# Altium schematic sheet TOP.SchDoc: TOP
size A4; SheetNumber: 1; SheetTotal: 2
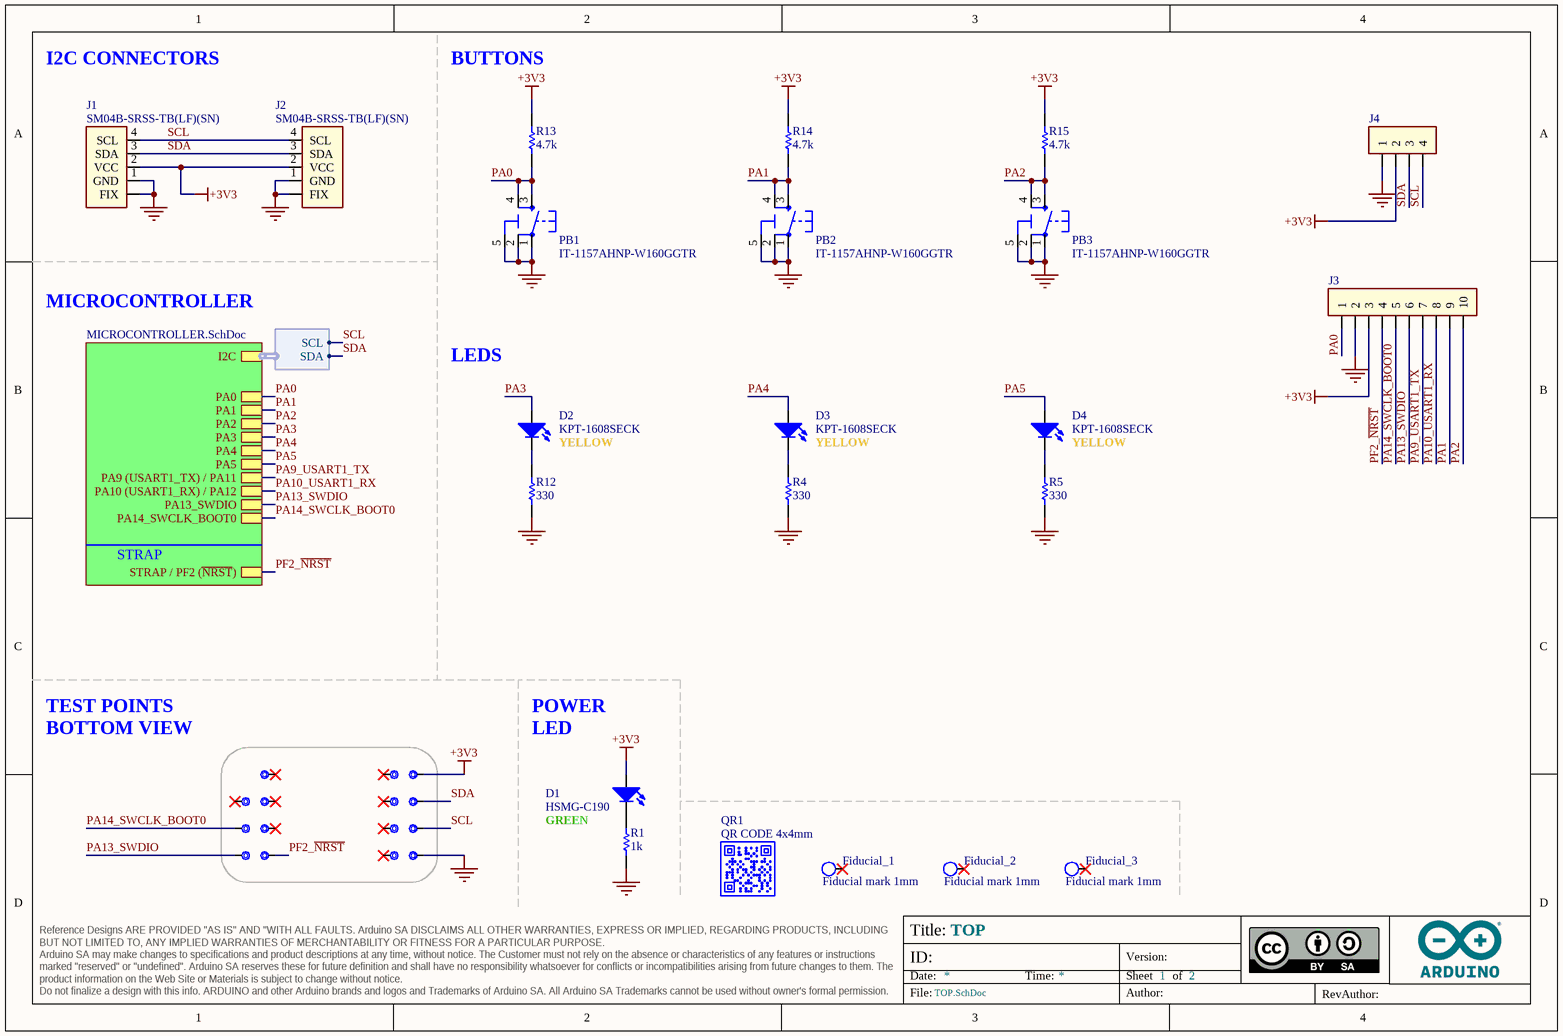
[diagram p0: TOP.SchDoc]

## Parts
3V3  Test point 1.00mm  [TP-1.00MM]  (value not drawn)  (no BOM)
D1  HSMG-C190  [LEDC1608X80N-AK]
D2  KPT-1608SECK  [LEDC1608X80N-AK]
D3  KPT-1608SECK  [LEDC1608X80N-AK]
D4  KPT-1608SECK  [LEDC1608X80N-AK]
Fiducial_1  Fiducial mark 1mm  [Fiducial mark 1mm-Footprint-1]  (no BOM)
Fiducial_2  Fiducial mark 1mm  [Fiducial mark 1mm-Footprint-1]  (no BOM)
Fiducial_3  Fiducial mark 1mm  [Fiducial mark 1mm-Footprint-1]  (no BOM)
GND  Test point 1.00mm  [TP-1.00MM]  (value not drawn)  (no BOM)
J1  SM04B-SRSS-TB(LF)(SN)  [SM04B-SRSS-TB(LF)(SN)-Footprint-1]
J2  SM04B-SRSS-TB(LF)(SN)  [SM04B-SRSS-TB(LF)(SN)-Footprint-1]
J3  HEADER TH 2.54mm VERT. 1x010POS  [PIN HEADER 2.54mm VERT. 1x10POS]  (value not drawn)  (no BOM)
J4  HEADER TH 2.54mm VERT. 1x004POS  [PIN HEADER 2.54mm VERT. 1x4POS-Footprint-1]  (value not drawn)  (no BOM)
NRST  Test point 1.00mm  [TP-1.00MM]  (value not drawn)  (no BOM)
PA6  Test point 1.00mm  [TP-1.00MM]  (value not drawn)  (no BOM)
PA7  Test point 1.00mm  [TP-1.00MM]  (value not drawn)  (no BOM)
PB1  IT-1157AHNP-W160GGTR  [TS42]
PB2  IT-1157AHNP-W160GGTR  [TS42]
PB3  IT-1157AHNP-W160GGTR  [TS42]
PC14  Test point 1.00mm  [TP-1.00MM]  (value not drawn)  (no BOM)
PC15  Test point 1.00mm  [TP-1.00MM]  (value not drawn)  (no BOM)
QR1  QR CODE 4x4mm  [QR CODE 4x4mm]  (no BOM)
R1  value 1k  [RES-0402]  (hidden comment: CRCW04021K00FKEDC)
R4  value 330  [RES-0402]  (hidden comment: CRCW0402330RJNED)
R5  value 330  [RES-0402]  (hidden comment: CRCW0402330RJNED)
R12  value 330  [RES-0402]  (hidden comment: CRCW0402330RJNED)
R13  value 4.7k  [RES-0402]  (hidden comment: RC0402FR-074K7L)
R14  value 4.7k  [RES-0402]  (hidden comment: RC0402FR-074K7L)
R15  value 4.7k  [RES-0402]  (hidden comment: RC0402FR-074K7L)
SCL  Test point 1.00mm  [TP-1.00MM]  (value not drawn)  (no BOM)
SDA  Test point 1.00mm  [TP-1.00MM]  (value not drawn)  (no BOM)
SWCLK  Test point 1.00mm  [TP-1.00MM]  (value not drawn)  (no BOM)
SWDIO  Test point 1.00mm  [TP-1.00MM]  (value not drawn)  (no BOM)
TP9  Test point 1.00mm  [TP-1.00MM]  (value not drawn)  (no BOM)
TP10  Test point 1.00mm  [TP-1.00MM]  (value not drawn)  (no BOM)
TP11  Test point 1.00mm  [TP-1.00MM]  (value not drawn)  (no BOM)
TP12  Test point 1.00mm  [TP-1.00MM]  (value not drawn)  (no BOM)

## Sub-sheets
U_MICROCONTROLLER = MICROCONTROLLER.SchDoc: I2C (harness I2C), PA0, PA1, PA2, PA3, PA4, PA5, PA13_SWDIO, PA14_SWCLK_BOOT0, PA9 (USART1_TX) / PA11, PA10 (USART1_RX) / PA12, STRAP / PF2 (~{NRST})

## Harnesses
I2C: SDA, SCL

## Nets
+3V3: 3V3.X D1.A J1.2(VCC) J2.2(VCC) J3.3 J4.2 R13.2 R14.2 R15.2
GND: GND.X J1.1(GND) J1.FIX J2.1(GND) J2.FIX J3.2 J4.1 PB1.1 PB1.2 PB1.5(5-GND) PB2.1 PB2.2 PB2.5(5-GND) PB3.1 PB3.2 PB3.5(5-GND) R1.1 R4.1 R5.1 R12.1
PA0: J3.1 PB1.3 PB1.4 R13.1 ; sheet U_MICROCONTROLLER/PA0
PA1: J3.9 PB2.3 PB2.4 R14.1 ; sheet U_MICROCONTROLLER/PA1
PA2: J3.10 PB3.3 PB3.4 R15.1 ; sheet U_MICROCONTROLLER/PA2
PA3: D2.A ; sheet U_MICROCONTROLLER/PA3
PA4: D3.A ; sheet U_MICROCONTROLLER/PA4
PA5: D4.A ; sheet U_MICROCONTROLLER/PA5
PA9_USART1_TX: J3.7 ; sheet U_MICROCONTROLLER/PA9 (USART1_TX) / PA11
PA10_USART1_RX: J3.8 ; sheet U_MICROCONTROLLER/PA10 (USART1_RX) / PA12
PA13_SWDIO: J3.6 SWCLK.X ; sheet U_MICROCONTROLLER/PA13_SWDIO
PA14_SWCLK_BOOT0: J3.5 SWDIO.X ; sheet U_MICROCONTROLLER/PA14_SWCLK_BOOT0
PF2_~{NRST}: J3.4 NRST.X ; sheet U_MICROCONTROLLER/STRAP / PF2 (~{NRST})
SCL: J1.4(SCL) J2.4(SCL) J4.4 SCL.X ; sheet U_MICROCONTROLLER/I2C.SCL
SDA: J1.3(SDA) J2.3(SDA) J4.3 SDA.X ; sheet U_MICROCONTROLLER/I2C.SDA
NetD1_C: D1.C R1.2
NetD2_C: D2.C R12.2
NetD3_C: D3.C R4.2
NetD4_C: D4.C R5.2

Not connected (* = marked no-connect by the designer): Fiducial_1 1*; Fiducial_2 1*; Fiducial_3 1*; PA6 X*; PA7 X*; PC14 X*; PC15 X*; TP9 X*; TP10 X*; TP11 X*; TP12 X*

## Notes on the sheet
- I2C CONNECTORS
- BUTTONS
- MICROCONTROLLER
- LEDS
- YELLOW
- STRAP
- TEST POINTS BOTTOM VIEW
- (near D1) POWER LED
- GREEN
- Title:
- ID:
- Date:
- Time:
- Version:
- Sheet
- of
- RevAuthor:
- Reference Designs ARE PROVIDED "AS IS" AND "WITH ALL FAULTS. Arduino SA DISCLAIMS ALL OTHER WARRANTIES, EXPRESS OR IMPLIED, REGARDING PRODUCTS, INCLUDING BUT NOT LIMITED TO, ANY IMPLIED WARRANTIES OF MERCHANTABILITY OR FITNESS FOR A PARTICULAR PURPOSE.
  Arduino SA may make changes to specifications and product descriptions at any time, without notice. The Customer must not rely on the absence or characteristics of any features or instructions marked "reserved" or "undefined". Arduino SA reserves these for future definition and shall have no responsibility whatsoever for conflicts or incompatibilities arising from future changes to them. The product information on the Web Site or Materials is subject to change without notice.
  Do not finalize a design with this info. ARDUINO and other Arduino brands and logos and Trademarks of Arduino SA. All Arduino SA Trademarks cannot be used without owner's formal permission.
- File:
- Author:

## Library data of the parts
3V3 GND NRST PA6 PA7 PC14 PC15 SCL SDA SWCLK SWDIO TP9-TP12 = UT0013-A.6: Manufacturer: This is not a component; Pin Count: 1; Code Arduino: This is not a component; Source: ut.SchLib; Design Item ID: CMP-018-0005-A.3; Part Number: This is not a component
D1 = L0009-A.5: LED SMD 0603 GREEN/568 15mcd 120^; Manufacturer: Broadcom; Code Arduino: 2204; Pin Count: 2; Part Number: HSMG-C190
D2-D4 = L0006-A.5: LED SMD 0603 ORANGE601 250mcd 120^; Manufacturer: Kingbright; Code Arduino: 2207; Pin Count: 2; Part Number: KPT-1608SECK
Fiducial_1-Fiducial_3 = UT0023-A.7: Fiducial mark 1mm clearance 2mm
J1 J2 = J0005-A.2: CONN JST 4POS SIDE 1MM TIN QWIIC; Code Arduino: J0005; Part Number: SM04B-SRSS-TB(LF)(SN); Manufacturer: JST
J3 = J0169-A.8: Code Arduino: J0169
J4 = J0162-A.5: Code Arduino: J0162
PB1-PB3 = B0005-A.9: PUSHBUTTON SMD 6x6 5 PINS; Manufacturer: Switronic; Code Arduino: 0946; Part Number: IT-1157AHNP-W160GGTR
QR1 = QR-0001-A.2: QR CODE 4x4mm on layer 34 (This is not a component); Code Arduino: QRCODE_4x4mm; Part Number: This is not a component; Manufacturer: This is not a component
R1 = R0007-A.24: RES CHIP 0402 1k 1% 1/16W; Manufacturer: Vishay; Code Arduino: 0140; Power: 62.5mW; Temperature coefficient: 100ppm; Part Number: CRCW04021K00FKEDC; Tolerance: 1%; Case Code (Imperial): 0402; Technology: Thick film
R4 R5 R12 = R0017-A.24: RES CHIP 0402 330R 5% 1/16W; Manufacturer: Vishay; Code Arduino: 2229; Power: 62.5mW; Temperature coefficient: 200ppm; Part Number: CRCW0402330RJNED; Tolerance: 5%; Case Code (Imperial): 0402; Technology: Thick film
R13-R15 = R0013-A.24: RES CHIP 0402 4k7 1% 1/16W; Manufacturer: YAGEO; Code Arduino: 2196; Power: 62.5mW; Temperature coefficient: 200ppm; Part Number: RC0402FR-074K7L; Tolerance: 1%; Case Code (Imperial): 0402; Technology: Thick film